# Altium schematic sheet 1_Schematic.SchDoc: USB Hub
size A3; Date: 14.09.2024; DrawnBy: Mert Ali ŞENTÜRK; Revision: 1.0; SheetNumber: 2; SheetTotal: 4
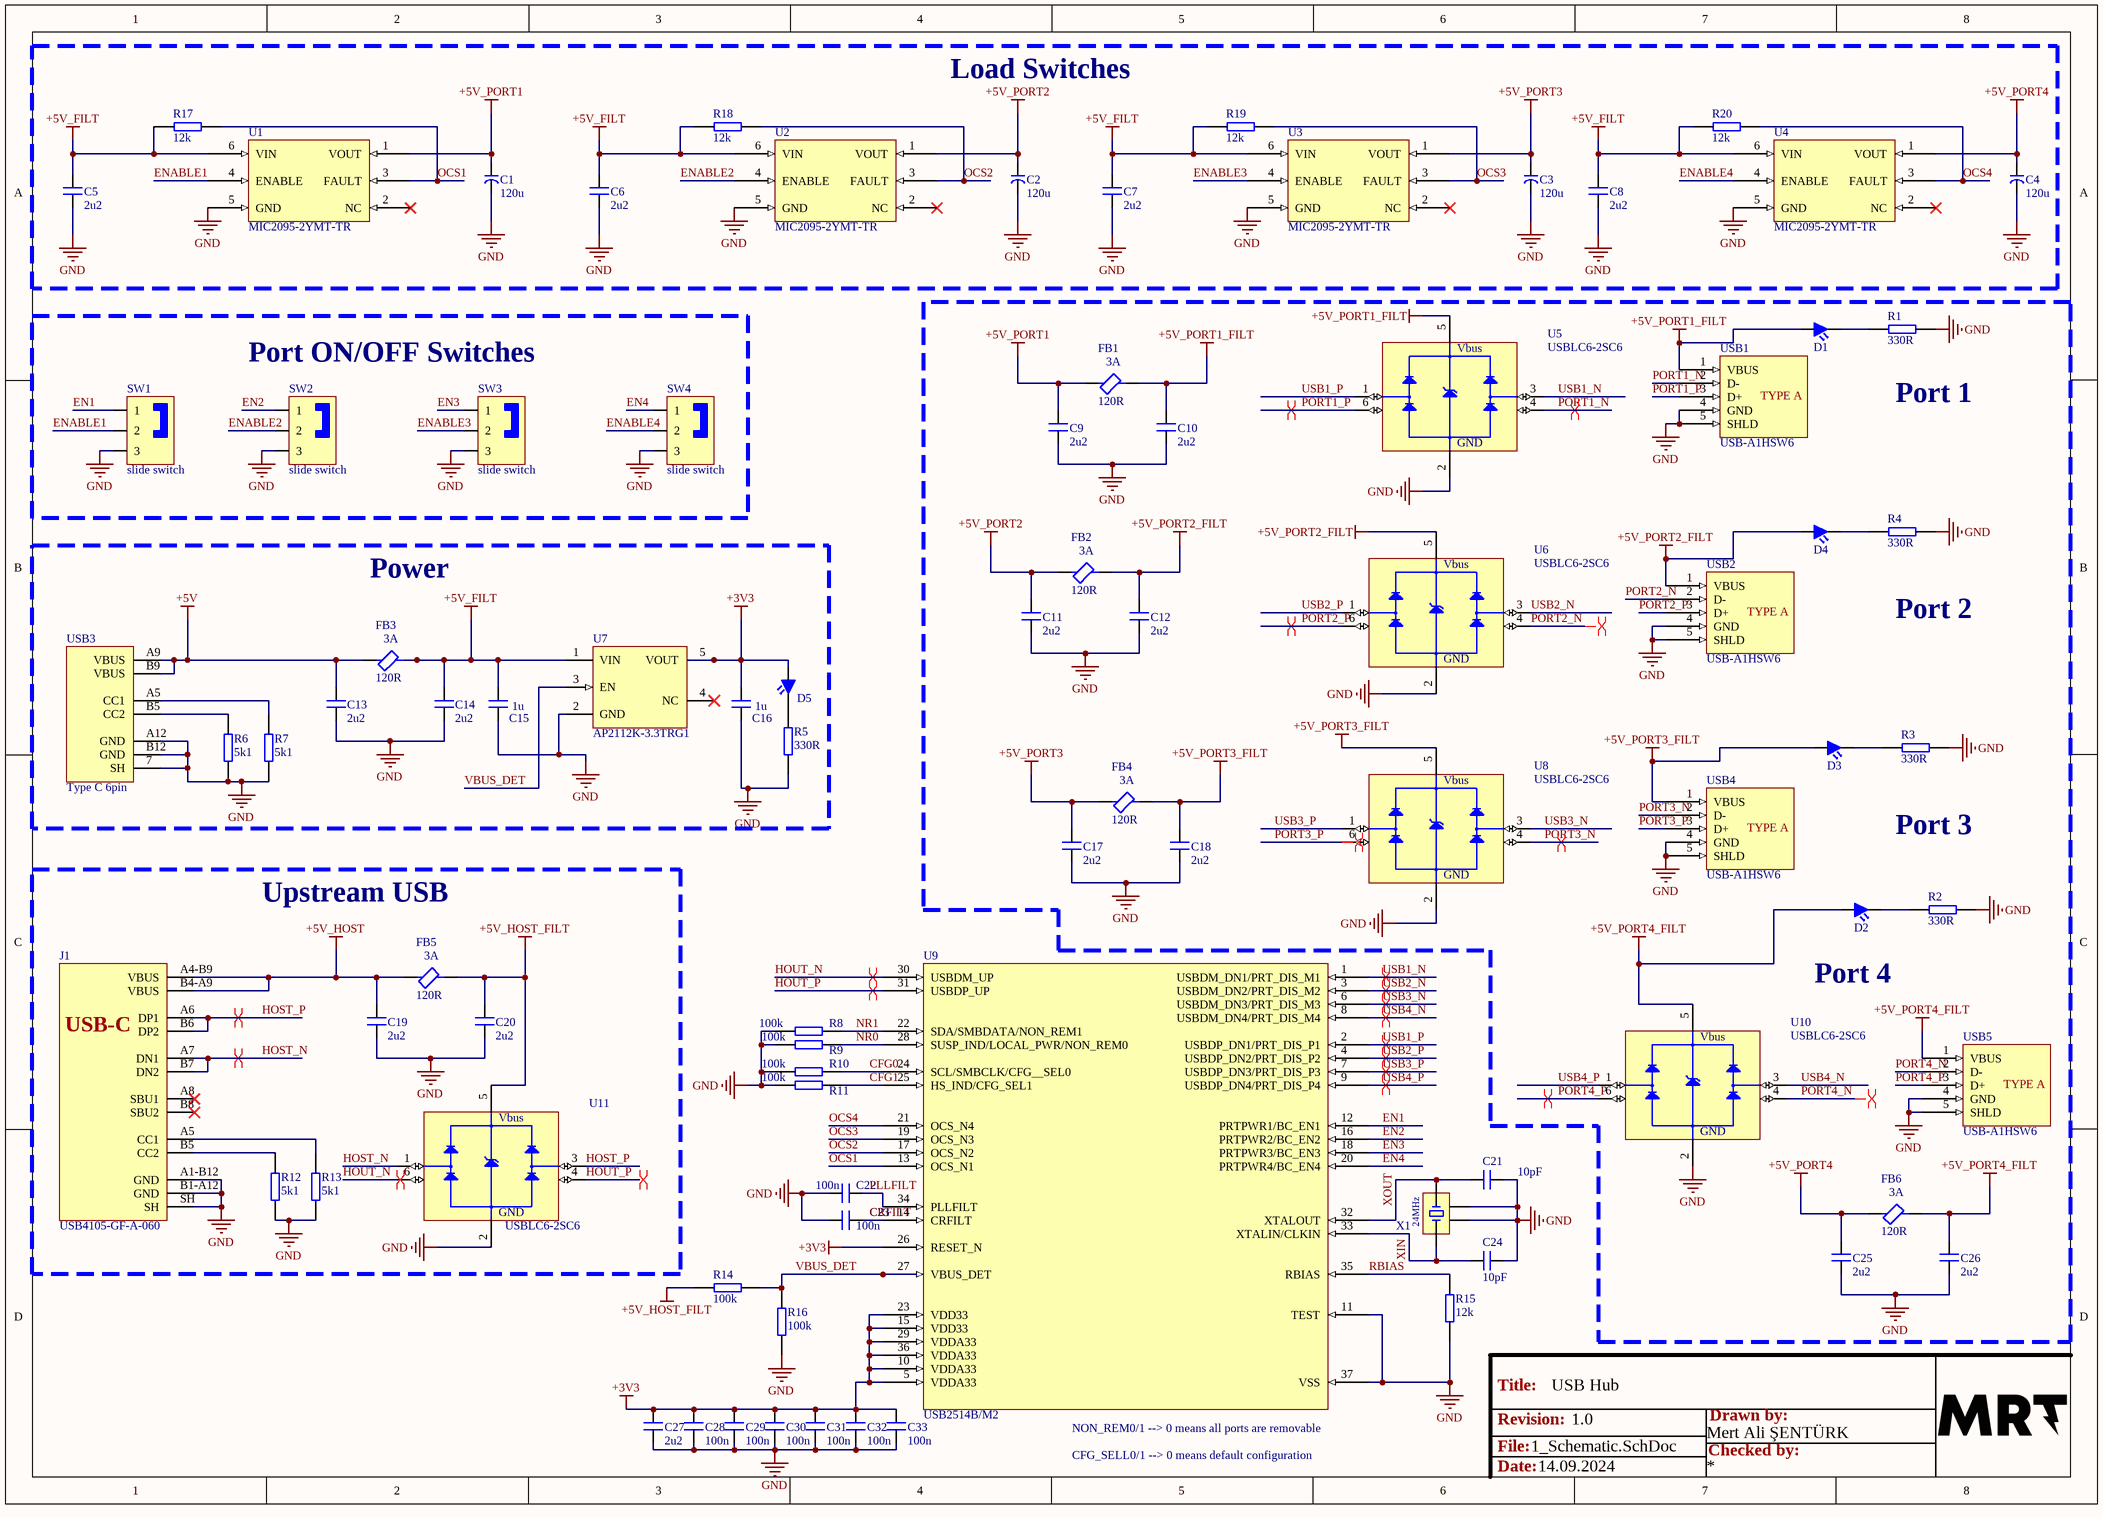
[diagram p0: 1_Schematic.SchDoc]

## Parts
C1  120u  [6.30mm Radial, Can - SMD]
C2  120u  [6.30mm Radial, Can - SMD]
C3  120u  [6.30mm Radial, Can - SMD]
C4  120u  [6.30mm Radial, Can - SMD]
C5  2u2  [0603 CAP]
C6  2u2  [0603 CAP]
C7  2u2  [0603 CAP]
C8  2u2  [0603 CAP]
C9  2u2  [0603 CAP]
C10  2u2  [0603 CAP]
C11  2u2  [0603 CAP]
C12  2u2  [0603 CAP]
C13  2u2  [0603 CAP]
C14  2u2  [0603 CAP]
C15  1u  [0603 CAP]
C16  1u  [0603 CAP]
C17  2u2  [0603 CAP]
C18  2u2  [0603 CAP]
C19  2u2  [0603 CAP]
C20  2u2  [0603 CAP]
C21  10pF  [0402 CAP]
C22  100n  [0402 CAP]
C23  100n  [0402 CAP]
C24  10pF  [0402 CAP]
C25  2u2  [0603 CAP]
C26  2u2  [0603 CAP]
C27  2u2  [0603 CAP]
C28  100n  [0402 CAP]
C29  100n  [0402 CAP]
C30  100n  [0402 CAP]
C31  100n  [0402 CAP]
C32  100n  [0402 CAP]
C33  100n  [0402 CAP]
D1  LED GREEN 0805  [LED 0805]  (value not drawn)
D2  LED GREEN 0805  [LED 0805]  (value not drawn)
D3  LED GREEN 0805  [LED 0805]  (value not drawn)
D4  LED GREEN 0805  [LED 0805]  (value not drawn)
D5  LED RED 0805  [LED 0805]  (value not drawn)
FB1  120R  [0603 FB]
FB2  120R  [0603 FB]
FB3  120R  [0603 FB]
FB4  120R  [0603 FB]
FB5  120R  [0603 FB]
FB6  120R  [0603 FB]
J1  USB4105-GF-A-060  [USB TYPE C GCT 16P]
R1  330R  [0402 RES]
R2  330R  [0402 RES]
R3  330R  [0402 RES]
R4  330R  [0402 RES]
R5  330R  [0402 RES]
R6  5k1  [0402 RES]
R7  5k1  [0402 RES]
R8  100k  [0603 RES]
R9  100k  [0603 RES]
R10  100k  [0603 RES]
R11  100k  [0603 RES]
R12  5k1  [0402 RES]
R13  5k1  [0402 RES]
R14  100k  [0603 RES]
R15  12k  [0603 RES]
R16  100k  [0603 RES]
R17  12k  [0603 RES]
R18  12k  [0603 RES]
R19  12k  [0603 RES]
R20  12k  [0603 RES]
SW1  slide switch  [EG1218]
SW2  slide switch  [EG1218]
SW3  slide switch  [EG1218]
SW4  slide switch  [EG1218]
U1  MIC2095-2YMT-TR  [6-UFDFN Exposed Pad]
U2  MIC2095-2YMT-TR  [6-UFDFN Exposed Pad]
U3  MIC2095-2YMT-TR  [6-UFDFN Exposed Pad]
U4  MIC2095-2YMT-TR  [6-UFDFN Exposed Pad]
U5  USBLC6-2SC6  [SOT23-6]
U6  USBLC6-2SC6  [SOT23-6]
U7  AP2112K-3.3TRG1  [SOT-23-5]
U8  USBLC6-2SC6  [SOT23-6]
U9  USB2514B/M2  [36-PIN SQFN]
U10  USBLC6-2SC6  [SOT23-6]
U11  USBLC6-2SC6  [SOT23-6]
USB1  USB-A1HSW6  [USB-A1HSW6]
USB2  USB-A1HSW6  [USB-A1HSW6]
USB3  Type C 6pin  [TYPE-C 6P(073)]
USB4  USB-A1HSW6  [USB-A1HSW6]
USB5  USB-A1HSW6  [USB-A1HSW6]
X1  TSX-3225 24.0000MF15X  [3225]  (value not drawn)

## Blocks framed on the sheet
Port ON/OFF Switches: SW1-SW4
Power: C13-C16 D5 FB3 R5-R7 U7 USB3

## Nets
+3V3: C16.2 C27.2 C28.2 C29.2 C30.2 C31.2 C32.2 C33.2 D5.2 U7.5(VOUT) U9.5(VDDA33) U9.10(VDDA33) U9.15(VDD33) U9.23(VDD33) U9.26(RESET_N) U9.29(VDDA33) U9.36(VDDA33)
+5V: C13.2 FB3.1 USB3.A9(VBUS) USB3.B9(VBUS)
+5V_FILT: C5.1 C6.1 C7.1 C8.1 C14.2 C15.2 FB3.2 R17.2 R18.2 R19.2 R20.2 U1.6(VIN) U2.6(VIN) U3.6(VIN) U4.6(VIN) U7.1(VIN)
+5V_HOST: C19.2 FB5.1 J1.A4-B9(VBUS) J1.B4-A9(VBUS)
+5V_HOST_FILT: C20.2 FB5.2 R14.2 U11.5(VBUS)
+5V_PORT1: C1.2 C9.2 FB1.1 U1.1(VOUT)
+5V_PORT1_FILT: C10.2 D1.2 FB1.2 U5.5(VBUS) USB1.1(VBUS)
+5V_PORT2: C2.2 C11.2 FB2.1 U2.1(VOUT)
+5V_PORT2_FILT: C12.2 D4.2 FB2.2 U6.5(VBUS) USB2.1(VBUS)
+5V_PORT3: C3.2 C17.2 FB4.1 U3.1(VOUT)
+5V_PORT3_FILT: C18.2 D3.2 FB4.2 U8.5(VBUS) USB4.1(VBUS)
+5V_PORT4: C4.2 C25.2 FB6.1 U4.1(VOUT)
+5V_PORT4_FILT: C26.2 D2.2 FB6.2 U10.5(VBUS) USB5.1(VBUS)
GND: C1.1 C2.1 C3.1 C4.1 C5.2 C6.2 C7.2 C8.2 C9.1 C10.1 C11.1 C12.1 C13.1 C14.1 C15.1 C16.1 C17.1 C18.1 C19.1 C20.1 C21.2 C22.2 C23.2 C24.2 C25.1 C26.1 C27.1 C28.1 C29.1 C30.1 C31.1 C32.1 C33.1 J1.A1-B12(GND) J1.B1-A12(GND) J1.SH R1.2 R2.2 R3.2 R4.2 R5.1 R6.1 R7.1 R8.2 R9.2 R10.2 R11.2 R12.1 R13.1 R15.1 R16.1 SW1.3 SW2.3 SW3.3 SW4.3 U1.5(GND) U2.5(GND) U3.5(GND) U4.5(GND) U5.2(GND) U6.2(GND) U7.2(GND) U8.2(GND) U9.11(TEST) U9.37(VSS) U10.2(GND) U11.2(GND) USB1.4(GND) USB1.5(SHLD) USB2.4(GND) USB2.5(SHLD) USB3.7(SH) USB3.A12(GND) USB3.B12(GND) USB4.4(GND) USB4.5(SHLD) USB5.4(GND) USB5.5(SHLD) X1.2 X1.4
CFG0: R10.1 U9.24(SCL/SMBCLK/CFG__SEL0)
CFG1: R11.1 U9.25(HS_IND/CFG_SEL1)
CRFILT: C23.1 U9.14(CRFILT)
EN1: SW1.1 U9.12(PRTPWR1/BC_EN1)
EN2: SW2.1 U9.16(PRTPWR2/BC_EN2)
EN3: SW3.1 U9.18(PRTPWR3/BC_EN3)
EN4: SW4.1 U9.20(PRTPWR4/BC_EN4)
ENABLE1: SW1.2 U1.4(ENABLE)
ENABLE2: SW2.2 U2.4(ENABLE)
ENABLE3: SW3.2 U3.4(ENABLE)
ENABLE4: SW4.2 U4.4(ENABLE)
HOST_N: J1.A7(DN1) J1.B7(DN2) U11.1(I/O1)
HOST_P: J1.A6(DP1) J1.B6(DP2) U11.3(I/O2)
HOUT_N: U9.30(USBDM_UP) U11.6(I/O1)
HOUT_P: U9.31(USBDP_UP) U11.4(I/O2)
NR0: R9.1 U9.28(SUSP_IND/LOCAL_PWR/NON_REM0)
NR1: R8.1 U9.22(SDA/SMBDATA/NON_REM1)
OCS1: R17.1 U1.3(FAULT) U9.13(OCS_N1)
OCS2: R18.1 U2.3(FAULT) U9.17(OCS_N2)
OCS3: R19.1 U3.3(FAULT) U9.19(OCS_N3)
OCS4: R20.1 U4.3(FAULT) U9.21(OCS_N4)
PLLFILT: C22.1 U9.34(PLLFILT)
PORT1_N: U5.4(I/O2) USB1.2(D-)
PORT1_P: U5.6(I/O1) USB1.3(D+)
PORT2_N: U6.4(I/O2) USB2.2(D-)
PORT2_P: U6.6(I/O1) USB2.3(D+)
PORT3_N: U8.4(I/O2) USB4.2(D-)
PORT3_P: U8.6(I/O1) USB4.3(D+)
PORT4_N: U10.4(I/O2) USB5.2(D-)
PORT4_P: U10.6(I/O1) USB5.3(D+)
RBIAS: R15.2 U9.35(RBIAS)
USB1_N: U5.3(I/O2) U9.1(USBDM_DN1/PRT_DIS_M1)
USB1_P: U5.1(I/O1) U9.2(USBDP_DN1/PRT_DIS_P1)
USB2_N: U6.3(I/O2) U9.3(USBDM_DN2/PRT_DIS_M2)
USB2_P: U6.1(I/O1) U9.4(USBDP_DN2/PRT_DIS_P2)
USB3_N: U8.3(I/O2) U9.6(USBDM_DN3/PRT_DIS_M3)
USB3_P: U8.1(I/O1) U9.7(USBDP_DN3/PRT_DIS_P3)
USB4_N: U9.8(USBDM_DN4/PRT_DIS_M4) U10.3(I/O2)
USB4_P: U9.9(USBDP_DN4/PRT_DIS_P4) U10.1(I/O1)
VBUS_DET: R14.1 R16.2 U7.3(EN) U9.27(VBUS_DET)
XIN: C24.1 U9.33(XTALIN/CLKIN) X1.1
XOUT: C21.1 U9.32(XTALOUT) X1.3
NetD1_1: D1.1 R1.1
NetD2_1: D2.1 R2.1
NetD3_1: D3.1 R3.1
NetD4_1: D4.1 R4.1
NetD5_1: D5.1 R5.2
NetJ1_A5: J1.A5(CC1) R13.2
NetJ1_B5: J1.B5(CC2) R12.2
NetR6_2: R6.2 USB3.B5(CC2)
NetR7_2: R7.2 USB3.A5(CC1)

Not connected (* = marked no-connect by the designer): J1 A8(SBU1)* B8(SBU2)*; U1 2(NC)*; U2 2(NC)*; U3 2(NC)*; U4 2(NC)*; U7 4(NC)*

## Layout directives
differential pair: HOST_N, HOST_P, HOUT_N, HOUT_P, PORT1_N, PORT1_P, PORT2_N, PORT2_P, PORT3_N, PORT3_P, PORT4_N, PORT4_P, USB1_N, USB1_P, USB2_N, USB2_P, USB3_N, USB3_P, USB4_N, USB4_P

## Notes on the sheet
- Load Switches
- (near R1) Port 1
- Port 2
- Port 3
- Upstream USB
- Port 4
- (near U9) NON_REM0/1 --> 0 means all ports are removable
- CFG_SELL0/1 --> 0 means default configuration
- Title:
- File:
- Revision:
- Checked by:
- Drawn by:
- Date:
- (in symbol TSX-3225 24.0000MF15X-AC3) 24MHz
- (in symbol USB TYPE C 16 PIN GCT) USB-C
- (in symbol USB-A1HSW6) TYPE A
- (in symbol USBLC6-2SC6) Vbus

## Library data of the parts
C1-C4 = CAP 120u Aluminum Electrolytic: Aluminum Electrolytic Capacitor, 120 uF, 35 V, ± 20%, 2000 hours @ 105°C, Radial Can - SMD; Manufacturer: Panasonic; Manufacturer Part Number: EEE-FNV121XUP; Supplier: Digikey; Supplier Part Number: 10-EEE-FNV121XUPCT-ND; RoHS: No; Category: Aluminum Electrolytic Capacitors; Stock: 6074; Pricing: 1=0,49, 10=0,33, 50=0,263, 100=0,2172 (USD); ComponentLink1URL: https://datasheet.octopart.com/EEEFNV121XUP-Panasonic-datasheet-165581510.pdf?src-supplier=TME; ComponentLink1Description: https://datasheet.octopart.com/EEEFNV121XUP-Panasonic-datasheet-165581510.pdf?src-supplier=TME
C5-C14 C17-C20 C25-C27 = 0603 2u2 CAP: Case: 0603
C15 C16 = 0603 1u CAP: Ceramic Capacitor, Multilayer, Ceramic, 25V, 10% +Tol, 10% -Tol, X7R, 15% TC, 1uF, Surface Mount, 0603; Manufacturer: Murata; Manufacturer Part Number: GCM188R71E105KA64D; Multilayer: Yes; Reference Standard: AEC-Q200; Case: 0603; Supplier: Digikey; Supplier Part Number: 490-10673-6-ND; RoHS: Yes; Category: Ceramic Capacitors; Stock: 2612025; Pricing: 1=0,24, 10=0,158, 50=0,1, 100=0,08, 500=0,05776, 1000=0,0511 (USD); Mounting Technology: Surface Mount; Pins: 2; Dielectric Material: Ceramic; Package Shape: Rectangular; Case/Package: 0603; Terminal Finish: Nickel; Min Operating Temperature: -55°C; Max Operating Temperature: 125°C; JESD-609 Code: e3; Value: 1uF; Capacitor Type: Ceramic; Tolerance  (fill in as +-): 10%; Package Style: SMTMeter; Packaging: Tape and Reel; Tolerance (fill in as +-): 10%; Rated DC Voltage (URdc): 25V; Temperature Characteristics Code: X7R; Termination: Wraparound; Length: 1.6mm; Width: 0.8mm; Height: 0.9mm; Reach SVHC Compliant: Yes; RoHS Compliant: Yes; ComponentLink1URL: https://datasheet.ciiva.com:443/pdfs/VipMasterIC/IC/MURE/MURE-S-A0004362469/MURE-S-A0004362812-1.pdf?src-supplier=IHS+Markit; ComponentLink1Description: https://datasheet.ciiva.com:443/pdfs/VipMasterIC/IC/MURE/MURE-S-A0004362469/MURE-S-A0004362812-1.pdf?src-supplier=IHS+Markit; ComponentLink2URL: https://datasheet.ciiva.com/11616/product-11616499.pdf?src-supplier=Avnet; ComponentLink2Description: https://datasheet.ciiva.com/11616/product-11616499.pdf?src-supplier=Avnet; ComponentLink3URL: https://datasheet.ciiva.com/26843/getdatasheetpartid-562446-26843671.pdf?src-supplier=Verical; ComponentLink3Description: https://datasheet.ciiva.com/26843/getdatasheetpartid-562446-26843671.pdf?src-supplier=Verical
C21 C24 = 0402 10p CAP: Ceramic Capacitor, Multilayer, Ceramic, 25V, 2% +Tol, 2% -Tol, C0G, 30ppm/Cel TC, 0.00001uF, Surface Mount, 01005; Manufacturer: Murata; Manufacturer Part Number: GRM0225C1E100GA03L; Multilayer: Yes; Case: 0402; Supplier: Digikey; Supplier Part Number: 490-13464-2-ND; RoHS: Yes; Category: Ceramic Capacitors; Stock: 400000; Pricing: 40000=0,00724, 80000=0,00648, 120000=0,00524, 200000=0,00507, 280000=0,00476 (USD); Mounting Technology: Surface Mount; Pins: 2; Dielectric Material: Ceramic; Package Shape: Rectangular; Min Operating Temperature: -55°C; Max Operating Temperature: 125°C; Value: 10pF; Capacitor Type: Ceramic; Tolerance  (fill in as +-): 2%; Packaging: Tape and Reel; Tolerance (fill in as +-): 2%; Rated DC Voltage (URdc): 25V; Temperature Characteristics Code: C0G; Termination: Wraparound; Reach SVHC Compliant: Yes; RoHS Compliant: Yes; ComponentLink1URL: https://datasheet.ciiva.com:443/pdfs/VipMasterIC/IC/MURE/MURE-S-A0004430058/MURE-S-A0004435504-1.pdf?src-supplier=IHS+Markit; ComponentLink1Description: https://datasheet.ciiva.com:443/pdfs/VipMasterIC/IC/MURE/MURE-S-A0004430058/MURE-S-A0004435504-1.pdf?src-supplier=IHS+Markit; ComponentLink2URL: https://search.murata.co.jp/Ceramy/image/img/A01X/G101/ENG/GRM0225C1E100GA03-01.pdf?src-supplier=Digikey; ComponentLink2Description: https://search.murata.co.jp/Ceramy/image/img/A01X/G101/ENG/GRM0225C1E100GA03-01.pdf?src-supplier=Digikey; ComponentLink3URL: http://search.murata.co.jp/Ceramy/image/img/A01X/G101/ENG/GRM0225C1E100GA03-01.pdf?src-supplier=Digikey; ComponentLink3Description: http://search.murata.co.jp/Ceramy/image/img/A01X/G101/ENG/GRM0225C1E100GA03-01.pdf?src-supplier=Digikey
C22 C23 C28-C33 = 0402 100n AP: Ceramic Capacitor, Multilayer, Ceramic, 25V, 10% +Tol, 10% -Tol, X7R, 15% TC, 0.1uF, Surface Mount, 0402; Manufacturer: Murata; Manufacturer Part Number: GRM155R71E104KE14J; Value: 100nF; Multilayer: Yes; Case: 0402; Supplier: Digikey; Supplier Part Number: 490-14603-1-ND; RoHS: Yes; Category: Ceramic Capacitors; Stock: 3911559; Pricing: 1=0,1, 10=0,024, 50=0,0136, 100=0,0105, 500=0,00794, 1000=0,00623, 2500=0,00566, 5000=0,00521 (USD); Mounting Technology: Surface Mount; Pins: 2; Dielectric Material: Ceramic; Package Shape: Rectangular; Case/Package: 0402; Terminal Finish: Nickel; Min Operating Temperature: -55°C; Max Operating Temperature: 125°C; JESD-609 Code: e3; Capacitor Type: Ceramic; Tolerance  (fill in as +-): 10%; Package Style: SMTMeter; Packaging: Tape and Reel; Tolerance (fill in as +-): 10%; Rated DC Voltage (URdc): 25V; Temperature Characteristics Code: X7R; Termination: Wraparound; Length: 1mm; Width: 0.5mm; Height: 0.5mm; Reach SVHC Compliant: Yes; RoHS Compliant: Yes; ComponentLink1URL: https://datasheet.ciiva.com:443/pdfs/VipMasterIC/IC/MURE/MURE-S-A0004362469/MURE-S-A0004364872-1.pdf?src-supplier=IHS+Markit; ComponentLink1Description: https://datasheet.ciiva.com:443/pdfs/VipMasterIC/IC/MURE/MURE-S-A0004362469/MURE-S-A0004364872-1.pdf?src-supplier=IHS+Markit; ComponentLink2URL: http://www.mouser.com/ds/2/281/c02e-2905.pdf?src-supplier=Mouser; ComponentLink2Description: http://www.mouser.com/ds/2/281/c02e-2905.pdf?src-supplier=Mouser; ComponentLink3URL: https://datasheet.octopart.com/GRM155R71E104KE14J-Murata-datasheet-155345056.pdf?src-supplier=Element14; ComponentLink3Description: https://datasheet.octopart.com/GRM155R71E104KE14J-Murata-datasheet-155345056.pdf?src-supplier=Element14; ComponentLink4URL: http://search.murata.co.jp/Ceramy/image/img/A01X/G101/ENG/GRM155R71E104KE14-01.pdf?src-supplier=Digikey; ComponentLink4Description: http://search.murata.co.jp/Ceramy/image/img/A01X/G101/ENG/GRM155R71E104KE14-01.pdf?src-supplier=Digikey; ComponentLink5URL: https://datasheet.octopart.com/GRM155R71E104KE14J-Murata-datasheet-165579666.pdf?src-supplier=TME; ComponentLink5Description: https://datasheet.octopart.com/GRM155R71E104KE14J-Murata-datasheet-165579666.pdf?src-supplier=TME
FB1-FB6 = BLM18KG121TN1D: Ferrite Chip, 1 Function(s), 3A, 2 Pin(s); Manufacturer: Murata; DC Resistance-Max: 30mR; Clock Frequency: 100MHz; Channels: 1; Supplier: Digikey; Supplier Part Number: 490-5254-1-ND; Manufacturer Part Number: BLM18KG121TN1D; RoHS: Yes; Category: Ferrite Beads and Chips; Stock: 2603406; Pricing: 1=0,1, 10=0,044, 25=0,0376, 50=0,0338, 100=0,0302, 250=0,02604, 500=0,02318, 1000=0,02055 (USD); Mounting Technology: Surface Mount; Material: Ferrite; Case Code: 0603; Terminal Finish: Tin; Min Operating Temperature: -55°C; Max Operating Temperature: 125°C; JESD-609 Code: e3; Construction: Chip Bead; Filter Type: FERRITE CHIP; Min Frequency: 100MHz; Output Impedance: 120R; Packaging: Tape and Reel; Current Rating: 3A; Length: 1.6mm; Width: 0.8mm; Height: 0.6mm; Reach SVHC Compliant: Yes; RoHS Compliant: Yes; ComponentLink1URL: https://datasheet.ciiva.com:443/pdfs/VipMasterIC/IC/MURE/MURE-S-A0008515923/MURE-S-A0008515923-1.pdf?src-supplier=IHS+Markit; ComponentLink1Description: https://datasheet.ciiva.com:443/pdfs/VipMasterIC/IC/MURE/MURE-S-A0008515923/MURE-S-A0008515923-1.pdf?src-supplier=IHS+Markit; ComponentLink2URL: https://datasheet.ciiva.com/11795/0900766b81076276-11795748.pdf?src-supplier=Rs; ComponentLink2Description: https://datasheet.ciiva.com/11795/0900766b81076276-11795748.pdf?src-supplier=Rs; ComponentLink3URL: https://datasheet.ciiva.com/22715/486545-22715701.pdf?src-supplier=Element14; ComponentLink3Description: https://datasheet.ciiva.com/22715/486545-22715701.pdf?src-supplier=Element14; ComponentLink4URL: https://datasheet.ciiva.com/1012/l0110e-1012354.pdf?src-supplier=Digikey; ComponentLink4Description: https://datasheet.ciiva.com/1012/l0110e-1012354.pdf?src-supplier=Digikey; ComponentLink5URL: https://datasheet.ciiva.com/1012/l0110e-1012353.pdf?src-supplier=Digikey; ComponentLink5Description: https://datasheet.ciiva.com/1012/l0110e-1012353.pdf?src-supplier=Digikey; ComponentLink6URL: https://datasheet.ciiva.com/1012/l0110e-1012355.pdf?src-supplier=Digikey; ComponentLink6Description: https://datasheet.ciiva.com/1012/l0110e-1012355.pdf?src-supplier=Digikey; ComponentLink7URL: https://datasheet.ciiva.com/41449/001172289-da-01-en-drossel-0603-120r-1-6x0-8mm-4000st-41449628.pdf?src-supplier=Conrad; ComponentLink7Description: https://datasheet.ciiva.com/41449/001172289-da-01-en-drossel-0603-120r-1-6x0-8mm-4000st-41449628.pdf?src-supplier=Conrad
J1 = USB TYPE C 16 PIN GCT: USB Connectors USB Type C, 2.0 SMT PCB Top Mnt .60mm; Manufacturer: GCT; Voltage Rating: 5V; Current Rating: 5A; Manufacturer Part Number: USB4105-GF-A-060
R1-R7 R12 R13 = 0402 RES: Case: 0402
R8-R11 R14-R20 = 0603 0R RES: Case: 0603
SW1-SW4 = slide switch: Slide Switch, 2 Positions, SPDT, Latched, 0.2A, 30VDC, 3 PCB Hole Cnt, Solder Terminal, Through Hole-straight EG1218; Manufacturer: E-Switch; Body Breadth: 4inch; Body Height: 5.4mm; Body Length or Diameter: 11.6mm; Supplier: Digikey; Supplier Part Number: EG1903-ND; Manufacturer Part Number: EG1218; RoHS: Yes; Category: Slide Switches; Stock: 58277; Pricing: 1=0,76, 10=0,727, 25=0,6996, 100=0,6071, 250=0,55396, 500=0,51478, 1000=0,46162, 2500=0,43364, 5000=0,40287 (USD); Mounting Technology: Through Hole; Terminal Finish: Silver; Min Operating Temperature: -20°C; Max Operating Temperature: 70°C; Switch Function: SPDT; Switch Type: Slide Switch; Termination: Solder; JESD-609 Code: e4; Switch Action: LATCHED; Reach SVHC Compliant: Yes; RoHS Compliant: Yes; ComponentLink1URL: https://datasheet.ciiva.com:443/pdfs/VipMasterIC/IC/ESCH/ESCH-S-A0005350660/ESCH-S-A0005350660-1.pdf?src-supplier=IHS+Markit; ComponentLink1Description: https://datasheet.ciiva.com:443/pdfs/VipMasterIC/IC/ESCH/ESCH-S-A0005350660/ESCH-S-A0005350660-1.pdf?src-supplier=IHS+Markit; ComponentLink2URL: https://datasheet.ciiva.com/1699/p040040c-1699451.pdf?src-supplier=Newark; ComponentLink2Description: https://datasheet.ciiva.com/1699/p040040c-1699451.pdf?src-supplier=Newark
U1-U4 = MIC2095-2YMT-TR: Power Supply Support Circuit, 500mA Cuurent Fixed, 1 Channel, PDSO6; Manufacturer: Microchip; Package Body Material: Plastic; Adjustable Threshold: No; Number of Channels: 1; Max Supply Voltage: 5.5V; Min Supply Voltage: 2.5V; Nominal Supply Voltage: 5V; Time @ Peak Reflow Temperature-Max (s): 40s; Qualification Status: Not Qualified; Supplier: Digikey; Supplier Part Number: 576-3780-1-ND; Manufacturer Part Number: MIC2095-2YMT-TR; RoHS: Yes; Category: Hot Swap Controllers; Stock: 8110; Pricing: 1=0,6, 25=0,52, 100=0,46 (USD); Case/Package: HVSON; Pins: 6; Package Shape: Square; Terminal Finish: Gold; Min Operating Temperature: -40°C; Max Operating Temperature: 85°C; JESD-609 Code: e4; Throw Configuration: POWER SUPPLY SUPPORT CIRCUIT; JESD-30 Code: S-PDSO-N6; Channels: 1; Package Style: SMALL OUTLINE, HEAT SINK/SLUG, VERY THIN PROFILEMeter; Peak Reflow Temperature (Cel): 260°C; Surface Mount: Yes; Terminal Form: No Lead; Terminal Position: DUAL; Length: 1.6mm; Width: 1.6mm; Height - Seated (Max): 0.6mm; Terminal Pitch: 0.5mm; Temperature Grade: INDUSTRIAL; Reach SVHC Compliant: Yes; RoHS Compliant: Yes; ComponentLink1URL: https://datasheet.ciiva.com:443/pdfs/VipMasterIC/IC/MCRL/MCRLS04132/MCRLS04132-1.pdf?src-supplier=IHS+Markit; ComponentLink1Description: https://datasheet.ciiva.com:443/pdfs/VipMasterIC/IC/MCRL/MCRLS04132/MCRLS04132-1.pdf?src-supplier=IHS+Markit; ComponentLink2URL: https://datasheet.ciiva.com/1963/mic2095-1963024.pdf?src-supplier=Digikey; ComponentLink2Description: https://datasheet.ciiva.com/1963/mic2095-1963024.pdf?src-supplier=Digikey; ComponentLink3URL: https://datasheet.ciiva.com/12183/mic2095-278268-12183148.pdf?src-supplier=Mouser; ComponentLink3Description: https://datasheet.ciiva.com/12183/mic2095-278268-12183148.pdf?src-supplier=Mouser; ComponentLink4URL: https://datasheet.ciiva.com/16452/mic2095-16452137.pdf?src-supplier=Future+Electronics; ComponentLink4Description: https://datasheet.ciiva.com/16452/mic2095-16452137.pdf?src-supplier=Future+Electronics
U5 U6 U8 U10 U11 = USBLC6-2SC6: Trans Voltage Suppressor Diode, 5V V(RWM), Unidirectional, 1 Element, Silicon; Manufacturer: STMicroelectronics; Package Body Material: Plastic; Additional Feature: HIGH RELIABILITY; Min Breakdown Voltage: 6V; Number of Elements: 1; Clamping Voltage-Max: 17V; Reference Standard: IEC-61000-4-2; Qualification Status: Not Qualified; Supplier: Digikey; Supplier Part Number: 497-5235-1-ND; Manufacturer Part Number: USBLC6-2SC6; RoHS: Yes; Category: TVS Diodes; Stock: 59063; Pricing: 1=0,58, 10=0,496, 100=0,3448, 500=0,2692, 1000=0,21881 (USD); Pins: 6; Package Shape: Rectangular; Terminal Finish: Tin; Diode Element Material: SILICON; Min Operating Temperature: -40°C; Max Operating Temperature: 125°C; JESD-609 Code: e3; Polarity: Unidirectional; Package Style: SMALL OUTLINEMeter; Diode Type: TRANS VOLTAGE SUPPRESSOR; JESD-30 Code: R-PDSO-G6; Moisture Sensitivity Level: 1; Rep Pk Reverse Voltage-Max: 5V; Surface Mount: Yes; Technology: AVALANCHE; Terminal Form: Gull Wing; Terminal Position: DUAL; Peak Reflow Temperature (Cel): 260°C; Reach SVHC Compliant: Yes; RoHS Compliant: Yes; ComponentLink1URL: https://datasheet.ciiva.com:443/pdfs/VipMasterIC/IC/SGST/SGSTS30336/SGSTS30336-1.pdf?src-supplier=IHS+Markit; ComponentLink1Description: https://datasheet.ciiva.com:443/pdfs/VipMasterIC/IC/SGST/SGSTS30336/SGSTS30336-1.pdf?src-supplier=IHS+Markit; ComponentLink2URL: https://datasheet.ciiva.com/1268/1690354-1268384.pdf?src-supplier=Element14; ComponentLink2Description: https://datasheet.ciiva.com/1268/1690354-1268384.pdf?src-supplier=Element14; ComponentLink3URL: https://datasheet.ciiva.com/4508/cd00050750-113117-4508433.pdf?src-supplier=Mouser; ComponentLink3Description: https://datasheet.ciiva.com/4508/cd00050750-113117-4508433.pdf?src-supplier=Mouser; ComponentLink4URL: https://datasheet.ciiva.com/15143/getdatasheetpartid-148465-15143789.pdf?src-supplier=Verical; ComponentLink4Description: https://datasheet.ciiva.com/15143/getdatasheetpartid-148465-15143789.pdf?src-supplier=Verical; ComponentLink5URL: https://datasheet.ciiva.com/16200/cd00050750-16200026.pdf?src-supplier=Future+Electronics; ComponentLink5Description: https://datasheet.ciiva.com/16200/cd00050750-16200026.pdf?src-supplier=Future+Electronics; ComponentLink6URL: https://datasheet.ciiva.com/41444/001184109-da-01-en-ic-esd-protecti-usblc6-2sc6-sot-23-6-stm-41444156.pdf?src-supplier=Conrad; ComponentLink6Description: https://datasheet.ciiva.com/41444/001184109-da-01-en-ic-esd-protecti-usblc6-2sc6-sot-23-6-stm-41444156.pdf?src-supplier=Conrad
U7 = AP2112K-3.3TRG1: Fixed Positive LDO Regulator, 3.3V, 0.4V Dropout, CMOS, PDSO5 600mA; Manufacturer: Diodes; Package Body Material: Plastic; Dropout Voltage1-Max: 400mV; Dropout Voltage1-Nom: 250mV; Input Voltage Absolute-Max: 6.5V; Max Supply Voltage: 6V; Min Input Voltage: 2.5V; Line Regulation-Max: 0.00561%; Load Regulation-Max: 0.0198%; Channels: 1; Output Voltage1-Max: 3.3495V; Output Voltage1-Min: 3.2505V; Package Equivalence Code: TSOP5/6,.11,37; Regulator Type: FIXED POSITIVE SINGLE OUTPUT LDO REGULATOR; Voltage Tolerance-Max: 1.5%; Qualification Status: Not Qualified; Supplier: Digikey; Supplier Part Number: AP2112K-3.3TRG1DICT-ND; Manufacturer Part Number: AP2112K-3.3TRG1; RoHS: Yes; Category: Voltage Regulators - Linear; Stock: 149041; Pricing: 1=0,35, 10=0,287, 25=0,2628, 100=0,1955, 250=0,1772, 500=0,14666, 1000=0,10999 (USD); Case/Package: LSSOP; Pins: 5; Package Shape: Rectangular; Terminal Finish: Tin; Min Operating Temperature: -40°C; Max Operating Temperature: 85°C; JESD-609 Code: e3; Adjustability: FIXED; JESD-30 Code: R-PDSO-G5; Moisture Sensitivity Level: 3; Number of Outputs: 1; Operating Temperature, TJ-Max: 85°C; Operating Temperature, TJ-Min: -40°C; Output Current1-Max: 600mA; Output Voltage1-Nom: 3.3V; Package Style: SMALL OUTLINE, LOW PROFILE, SHRINK PITCHMeter; Packaging: Tape and Reel; Surface Mount: Yes; Technology: CMOS; Terminal Form: Gull Wing; Terminal Position: DUAL; Length: 2.92mm; Width: 1.6mm; Height - Seated (Max): 1.45mm; Terminal Pitch: 0.95mm; Reach SVHC Compliant: Yes; RoHS Compliant: Yes; ComponentLink1URL: https://datasheet.ciiva.com:443/pdfs/VipMasterIC/IC/DIOD/DIOD-S-A0003551552/DIOD-S-A0003551552-1.pdf?src-supplier=IHS+Markit; ComponentLink1Description: https://datasheet.ciiva.com:443/pdfs/VipMasterIC/IC/DIOD/DIOD-S-A0003551552/DIOD-S-A0003551552-1.pdf?src-supplier=IHS+Markit; ComponentLink2URL: https://datasheet.ciiva.com/30016/ap2112-30016792.pdf?src-supplier=Avnet; ComponentLink2Description: https://datasheet.ciiva.com/30016/ap2112-30016792.pdf?src-supplier=Avnet; ComponentLink3URL: https://datasheet.ciiva.com/29569/ap2112-29569918.pdf?src-supplier=Digikey; ComponentLink3Description: https://datasheet.ciiva.com/29569/ap2112-29569918.pdf?src-supplier=Digikey; ComponentLink4URL: https://datasheet.ciiva.com/29569/ap2112-29569919.pdf?src-supplier=Digikey; ComponentLink4Description: https://datasheet.ciiva.com/29569/ap2112-29569919.pdf?src-supplier=Digikey; ComponentLink5URL: https://datasheet.ciiva.com/29569/ap2112-29569917.pdf?src-supplier=Digikey; ComponentLink5Description: https://datasheet.ciiva.com/29569/ap2112-29569917.pdf?src-supplier=Digikey
U9 = USB2514B/M2: USB Bus Controller, CMOS; Manufacturer: Microchip; Max Supply Voltage: 3.6V; Min Supply Voltage: 3V; Nominal Supply Voltage: 3.3V; Supplier: Digikey; Supplier Part Number: USB2514B/M2-ND; Manufacturer Part Number: USB2514B/M2; RoHS: Yes; Category: DSPs - Digital Signal Processors; Stock: 24694; Pricing: 1=2,77, 25=2,31, 100=2,225 (USD); Case/Package: HVQCCN; Pins: 36; Package Shape: Square; Terminal Finish: Tin; Min Operating Temperature: 0°C; Max Operating Temperature: 85°C; JESD-609 Code: e3; Package Style: CHIP CARRIER, HEAT SINK/SLUG, VERY THIN PROFILEMeter; Surface Mount: Yes; Technology: CMOS; Terminal Form: No Lead; Terminal Position: QUAD; Length: 6mm; Width: 6mm; Height - Seated (Max): 1mm; Terminal Pitch: 0.5mm; Temperature Grade: OTHER; Reach SVHC Compliant: Yes; RoHS Compliant: Yes; ComponentLink1URL: https://datasheet.ciiva.com:443/pdfs/VipMasterIC/IC/MCHP/MCHP-S-A0001117205/MCHP-S-A0001117205-1.pdf?src-supplier=IHS+Markit; ComponentLink1Description: https://datasheet.ciiva.com:443/pdfs/VipMasterIC/IC/MCHP/MCHP-S-A0001117205/MCHP-S-A0001117205-1.pdf?src-supplier=IHS+Markit; ComponentLink2URL: http://www.farnell.com/datasheets/2032129.pdf?src-supplier=Farnell; ComponentLink2Description: http://www.farnell.com/datasheets/2032129.pdf?src-supplier=Farnell; ComponentLink3URL: http://www.microchip.com/mymicrochip/filehandler.aspx?ddocname=en562310&src-supplier=Digikey; ComponentLink3Description: http://www.microchip.com/mymicrochip/filehandler.aspx?ddocname=en562310&src-supplier=Digikey; ComponentLink4URL: http://ww1.microchip.com/downloads/en/DeviceDoc/00001692B.pdf?src-supplier=Avnet; ComponentLink4Description: http://ww1.microchip.com/downloads/en/DeviceDoc/00001692B.pdf?src-supplier=Avnet; ComponentLink5URL: https://datasheet.octopart.com/USB2514B-M2-Microchip-datasheet-133510383.pdf?src-supplier=Future+Electronics; ComponentLink5Description: https://datasheet.octopart.com/USB2514B-M2-Microchip-datasheet-133510383.pdf?src-supplier=Future+Electronics
USB1 USB2 USB4 USB5 = USB-A1HSW6: USB Connector, 4 Contact(s), Female, Right Angle, Solder Terminal, Locking; Manufacturer: On-Shore Technology; Board Mounting Option: SOLDER HOLDING FLANGE; Contact Resistance: 30mR; Insulation Resistance: 1GR; Number Of Connectors: 1; PCB Contact Pattern: RECTANGULAR; Polarization Key: POLARIZED HOUSING; Rated Current (Signal): 1A; Number of Contacts: 4; Body Breadth: 0.272inch; Body Depth: 0.555inch; Body Length: 0.571inch; Reference Standard: UL; Reliability: COMMERCIAL; Supplier: Digikey; Supplier Part Number: ED2989-ND; Manufacturer Part Number: USB-A1HSW6; RoHS: Yes; Category: Connectors; Stock: 23923; Pricing: 1=0,68, 10=0,516, 25=0,464, 40=0,43925, 80=0,40563, 230=0,36013, 440=0,33527, 945=0,30869, 2400=0,27991 (USD); Mounting Technology: Board; Contact Material: Bronze; Contact Finish - Mating: AU ON NI; Insulation Material: Glass; Shell Finish: Copper; Shell Material: Brass; Min Operating Temperature: 0°C; Max Operating Temperature: 85°C; Connector Type: USB; Contact Gender: Female; Contact Style: USB; Manufacturer Series: USB; Mounting Style: RIGHT ANGLE; Number Of PCB Rows: 1; Termination: Solder; Mounting Option 1: LOCKING; Terminal Length: 0.11inch; Terminal Pitch: 2.0066mm; Reach SVHC Compliant: Yes; RoHS Compliant: Yes; ComponentLink1URL: https://datasheet.ciiva.com:443/pdfs/VipMasterIC/IC/ONST/ONST-S-Z0000000698/ONST-S-Z0000000698-1.pdf?src-supplier=IHS+Markit; ComponentLink1Description: https://datasheet.ciiva.com:443/pdfs/VipMasterIC/IC/ONST/ONST-S-Z0000000698/ONST-S-Z0000000698-1.pdf?src-supplier=IHS+Markit; ComponentLink2URL: https://datasheet.ciiva.com/851/usb-a1hsxx-851712.pdf?src-supplier=Digikey; ComponentLink2Description: https://datasheet.ciiva.com/851/usb-a1hsxx-851712.pdf?src-supplier=Digikey
USB3 = USB TYPE-C 6P(073) (Right Angle): Manufacturer SHOU HAN / MFR.Part # TYPE-C 6P(073) / JLCPCB Part # C668623; Current Rating: 5A; Voltage Rating: 5V; Manufacturer: SHOU HAN; JLCPCB Part: C668623
X1 = TSX-3225 24.0000MF15X-AC3: Crystals 24MHz 10ppm 9pF-40C +85C